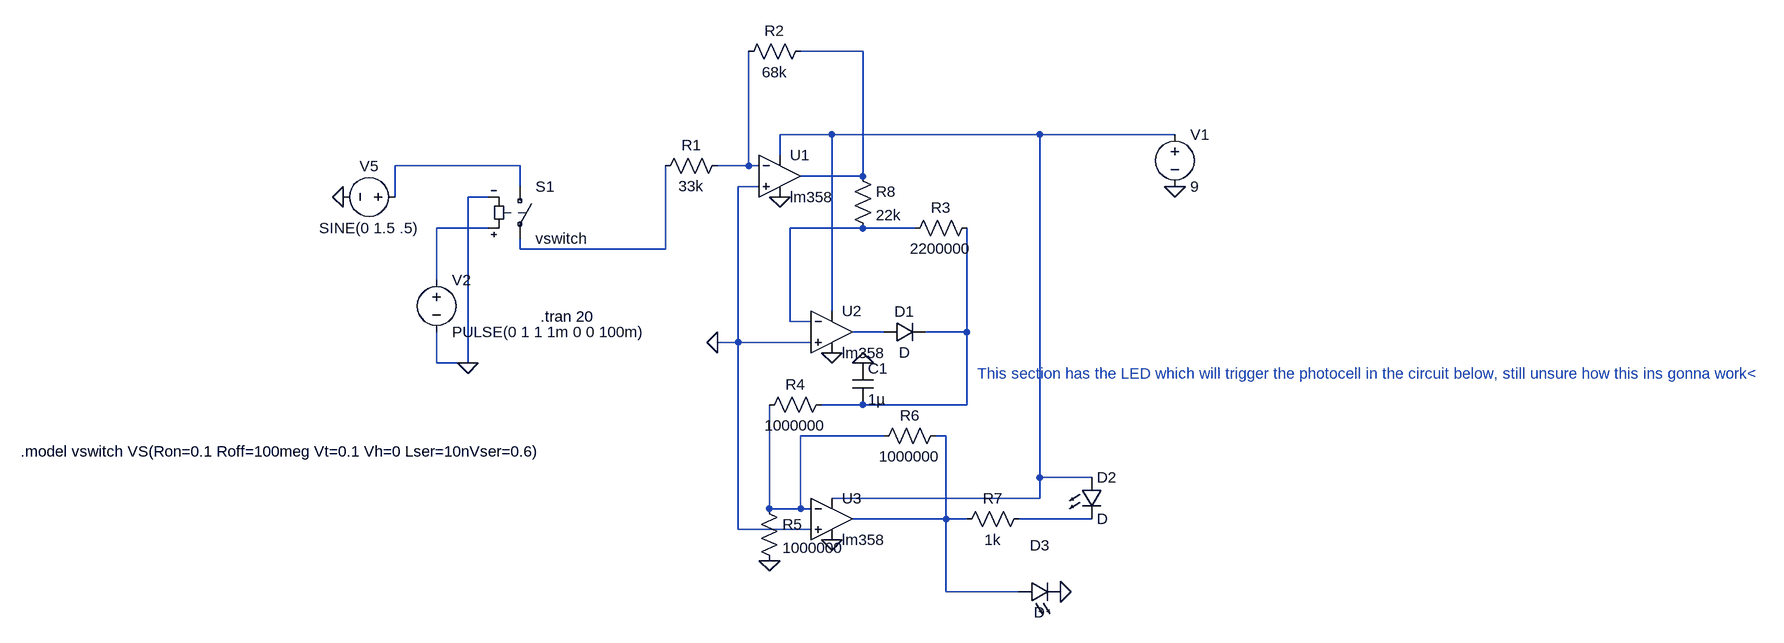
[diagram p0: schematic Followerimnotsure.asc]
Followerimnotsure.asc, the LTspice schematic file:
Version 4
SHEET 1 880 784
WIRE -896 -96 -992 -96
WIRE -944 32 -1024 32
WIRE -624 32 -944 32
WIRE -416 32 -624 32
WIRE -1024 64 -1024 32
WIRE -1424 80 -1616 80
WIRE -1072 80 -1072 -96
WIRE -1072 80 -1120 80
WIRE -1056 80 -1072 80
WIRE -896 96 -896 -96
WIRE -896 96 -992 96
WIRE -1424 112 -1424 80
WIRE -1056 112 -1088 112
WIRE -1616 128 -1616 80
WIRE -1472 128 -1504 128
WIRE -1472 176 -1552 176
WIRE -896 176 -1008 176
WIRE -816 176 -896 176
WIRE -1424 208 -1424 192
WIRE -1200 208 -1200 80
WIRE -1200 208 -1424 208
WIRE -1552 256 -1552 176
WIRE -944 304 -944 32
WIRE -1008 320 -1008 176
WIRE -976 320 -1008 320
WIRE -864 336 -912 336
WIRE -736 336 -736 176
WIRE -736 336 -800 336
WIRE -1088 352 -1088 112
WIRE -1088 352 -1120 352
WIRE -976 352 -1088 352
WIRE -1552 384 -1552 336
WIRE -1504 384 -1504 128
WIRE -1504 384 -1552 384
WIRE -896 448 -960 448
WIRE -736 448 -736 336
WIRE -736 448 -896 448
WIRE -864 496 -992 496
WIRE -768 496 -784 496
WIRE -624 560 -624 32
WIRE -544 560 -624 560
WIRE -624 592 -624 560
WIRE -624 592 -944 592
WIRE -1040 608 -1040 448
WIRE -992 608 -992 496
WIRE -992 608 -1040 608
WIRE -976 608 -992 608
WIRE -768 624 -768 496
WIRE -768 624 -912 624
WIRE -736 624 -768 624
WIRE -544 624 -656 624
WIRE -1088 640 -1088 352
WIRE -976 640 -1088 640
WIRE -768 736 -768 624
WIRE -656 736 -768 736
FLAG -1040 688 0
FLAG -944 656 0
FLAG -896 384 0
FLAG -944 368 0
FLAG -1024 128 0
FLAG -592 736 0
FLAG -1696 128 0
FLAG -1120 352 0
FLAG -416 112 0
FLAG -1504 384 0
SYMBOL lm358 -1024 32 R0
SYMATTR InstName U1
SYMBOL res -1104 64 R90
WINDOW 0 0 56 VBottom 2
WINDOW 3 32 56 VTop 2
SYMATTR InstName R1
SYMATTR Value 33k
SYMBOL lm358 -944 272 R0
SYMATTR InstName U2
SYMBOL lm358 -944 560 R0
SYMATTR InstName U3
SYMBOL res -976 -112 R90
WINDOW 0 0 56 VBottom 2
WINDOW 3 32 56 VTop 2
SYMATTR InstName R2
SYMATTR Value 68k
SYMBOL diode -864 352 R270
WINDOW 0 32 32 VTop 2
WINDOW 3 0 32 VBottom 2
SYMATTR InstName D1
SYMBOL res -720 160 R90
WINDOW 0 0 56 VBottom 2
WINDOW 3 32 56 VTop 2
SYMATTR InstName R3
SYMATTR Value 2200000
SYMBOL res -944 432 R90
WINDOW 0 0 56 VBottom 2
WINDOW 3 32 56 VTop 2
SYMATTR InstName R4
SYMATTR Value 1000000
SYMBOL cap -912 384 R0
SYMATTR InstName C1
SYMATTR Value 1µ
SYMBOL res -1056 592 R0
SYMATTR InstName R5
SYMATTR Value 1000000
SYMBOL res -768 480 R90
WINDOW 0 0 56 VBottom 2
WINDOW 3 32 56 VTop 2
SYMATTR InstName R6
SYMATTR Value 1000000
SYMBOL res -640 608 R90
WINDOW 0 0 56 VBottom 2
WINDOW 3 32 56 VTop 2
SYMATTR InstName R7
SYMATTR Value 1k
SYMBOL LED -560 560 R0
SYMATTR InstName D2
SYMBOL res -912 80 R0
SYMATTR InstName R8
SYMATTR Value 22k
SYMBOL LED -656 752 R270
WINDOW 0 72 32 VTop 2
WINDOW 3 0 32 VBottom 2
SYMATTR InstName D3
SYMBOL voltage -1600 128 R90
WINDOW 0 -32 56 VBottom 2
WINDOW 3 32 56 VTop 2
WINDOW 123 0 0 Left 0
WINDOW 39 0 0 Left 0
SYMATTR InstName V5
SYMATTR Value SINE(0 1.5 .5)
SYMBOL voltage -416 16 R0
WINDOW 123 0 0 Left 0
WINDOW 39 0 0 Left 0
SYMATTR InstName V1
SYMATTR Value 9
SYMBOL sw -1424 96 R0
SYMATTR InstName S1
SYMATTR Value vswitch
SYMATTR SpiceModel vswitch
SYMBOL voltage -1552 240 R0
WINDOW 123 0 0 Left 0
WINDOW 39 0 0 Left 0
SYMATTR InstName V2
SYMATTR Value PULSE(0 1 1 1m 0 0 100m)
TEXT -720 400 Left 2 ;This section has the LED which will trigger the photocell in the circuit below, still unsure how this ins gonna work<
TEXT -1392 312 Left 2 !.tran 20
TEXT -2192 520 Left 2 !.model vswitch VS(Ron=0.1 Roff=100meg Vt=0.1 Vh=0 Lser=10nVser=0.6)

The netlist it stands for:
* Followerimnotsure.asc
* U1: lm358 (symbol lm358 not available, pins judged from their places): In+=0 In-=N004 V+=N002 V-=0 OUT=N001
R1 N004 N007 33k
* U2: lm358 (symbol lm358 not available, pins judged from their places): In+=0 In-=N006 V+=N002 V-=0 OUT=N008
* U3: lm358 (symbol lm358 not available, pins judged from their places): In+=0 In-=N010 V+=N002 V-=0 OUT=N011
R2 N001 N004 68k
D1 N008 N009 D
R3 N009 N006 2200000
R4 N009 N010 1000000
C1 0 N009 1µ
R5 N010 0 1000000
R6 N011 N010 1000000
R7 N012 N011 1k
D2 N002 N012 D
R8 N001 N006 22k
D3 N011 0 D
V5 N003 0 SINE(0 1.5 .5)
V1 N002 0 9
S1 N003 N007 N005 0 vswitch vswitch
V2 N005 0 PULSE(0 1 1 1m 0 0 100m)
.model D D
.lib standard.dio
* This section has the LED which will trigger the photocell in the circuit below, still unsure how this ins gonna work<
.tran 20
.model vswitch VS(Ron=0.1 Roff=100meg Vt=0.1 Vh=0 Lser=10nVser=0.6)
.backanno
.end